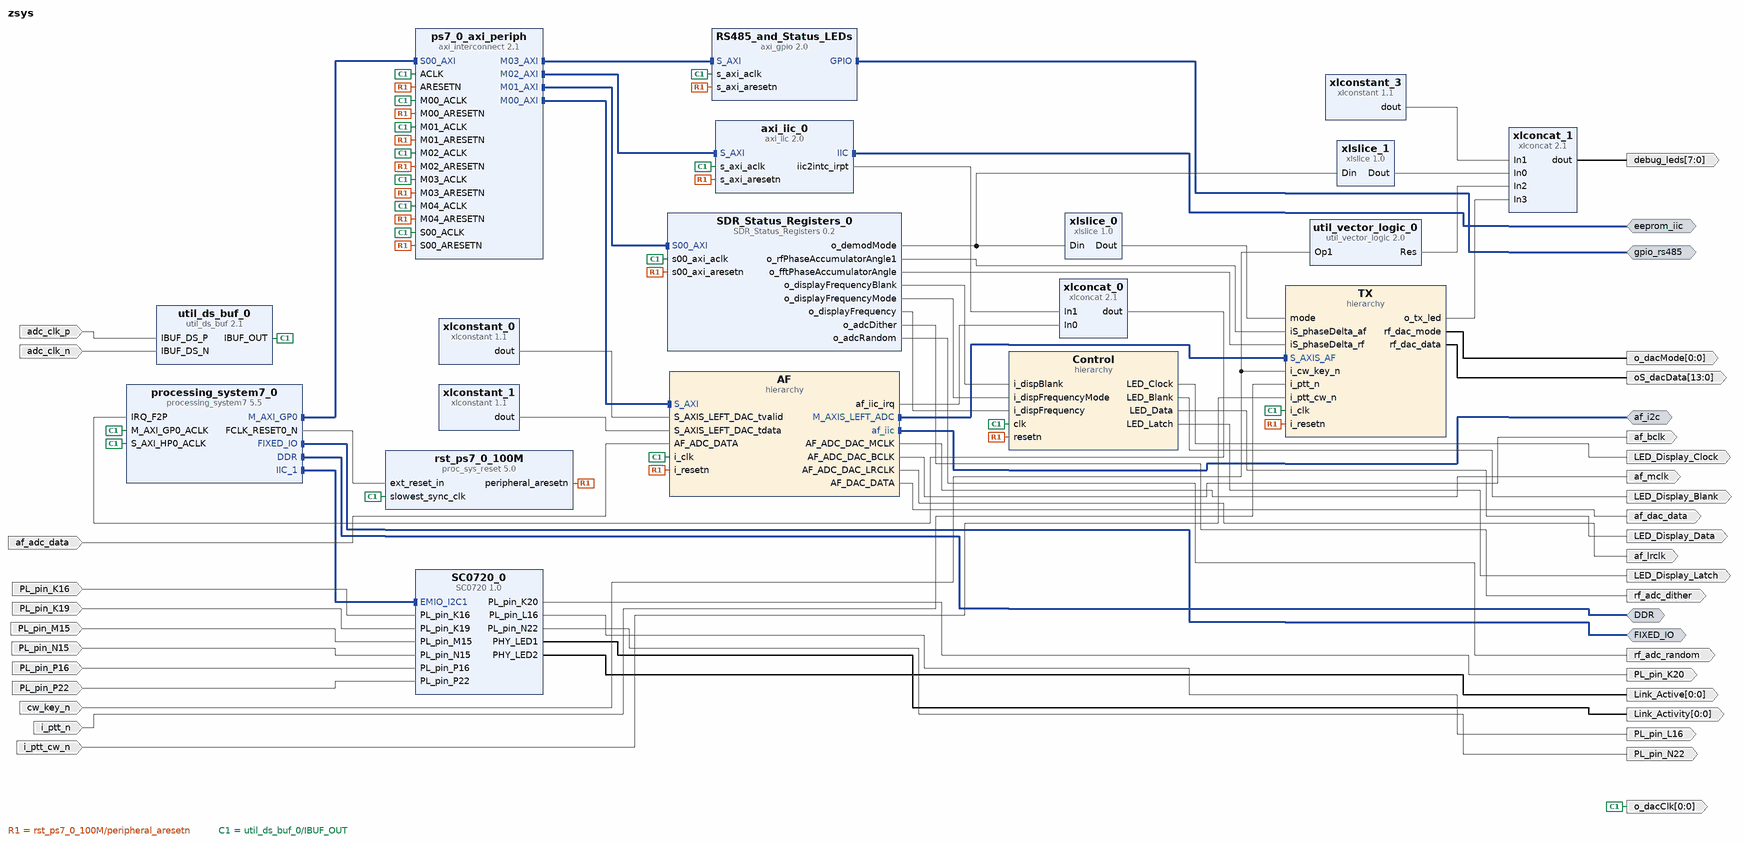
[diagram p0: block diagram of the top level]
# Vivado block design zsys, xc7z020clg484-1, Vivado 2019.2
create_bd_design zsys

create_bd_intf_port -mode Master -vlnv xilinx.com:interface:ddrx_rtl:1.0 DDR
create_bd_intf_port -mode Master -vlnv xilinx.com:display_processing_system7:fixedio_rtl:1.0 FIXED_IO
create_bd_intf_port -mode Master -vlnv xilinx.com:interface:iic_rtl:1.0 af_i2c
create_bd_intf_port -mode Master -vlnv xilinx.com:interface:gpio_rtl:1.0 gpio_rs485
create_bd_intf_port -mode Master -vlnv xilinx.com:interface:iic_rtl:1.0 eeprom_iic
create_bd_port -dir I PL_pin_K16
create_bd_port -dir I PL_pin_K19
create_bd_port -dir O PL_pin_K20
create_bd_port -dir O PL_pin_L16
create_bd_port -dir I PL_pin_M15
create_bd_port -dir I PL_pin_N15
create_bd_port -dir O PL_pin_N22
create_bd_port -dir I PL_pin_P16
create_bd_port -dir I PL_pin_P22
create_bd_port -dir O -from 0 -to 0 Link_Activity
create_bd_port -dir O -from 0 -to 0 Link_Active
create_bd_port -dir I -type clk adc_clk_p
set_property -dict {CONFIG.FREQ_HZ 80000000} [get_bd_ports adc_clk_p]
create_bd_port -dir I -type clk adc_clk_n
set_property -dict {CONFIG.FREQ_HZ 80000000} [get_bd_ports adc_clk_n]
create_bd_port -dir O LED_Display_Clock
create_bd_port -dir O LED_Display_Data
create_bd_port -dir O LED_Display_Latch
create_bd_port -dir O LED_Display_Blank
create_bd_port -dir O rf_adc_dither
create_bd_port -dir O rf_adc_random
create_bd_port -dir O -type clk af_bclk
create_bd_port -dir O -type clk af_mclk
create_bd_port -dir O -type clk af_lrclk
create_bd_port -dir O af_dac_data
create_bd_port -dir I af_adc_data
create_bd_port -dir O -from 7 -to 0 debug_leds
create_bd_port -dir O -from 13 -to 0 oS_dacData
create_bd_port -dir O -from 0 -to 0 o_dacMode
create_bd_port -dir O -from 0 -to 0 -type clk o_dacClk
create_bd_port -dir I cw_key_n
create_bd_port -dir I i_ptt_n
create_bd_port -dir I i_ptt_cw_n

create_bd_cell -type ip -vlnv trenz.biz:user:SC0720:1.0 SC0720_0
create_bd_cell -type hier Control
create_bd_cell -type hier AF
create_bd_cell -type ip -vlnv xilinx.com:ip:xlconcat:2.1 xlconcat_0
set_property -dict {CONFIG.NUM_PORTS 2} [get_bd_cells xlconcat_0]
create_bd_cell -type ip -vlnv xilinx.com:ip:processing_system7:5.5 processing_system7_0
set_property -dict [list \
  CONFIG.PCW_APU_PERIPHERAL_FREQMHZ 666.666666 \
  CONFIG.PCW_ENET0_ENET0_IO {MIO 16 .. 27} \
  CONFIG.PCW_ENET0_GRP_MDIO_ENABLE 1 \
  CONFIG.PCW_ENET0_GRP_MDIO_IO {MIO 52 .. 53} \
  CONFIG.PCW_ENET0_PERIPHERAL_ENABLE 1 \
  CONFIG.PCW_ENET_RESET_ENABLE 0 \
  CONFIG.PCW_FPGA0_PERIPHERAL_FREQMHZ 100 \
  CONFIG.PCW_FPGA1_PERIPHERAL_FREQMHZ 100 \
  CONFIG.PCW_GPIO_EMIO_GPIO_ENABLE 1 \
  CONFIG.PCW_GPIO_EMIO_GPIO_IO 64 \
  CONFIG.PCW_GPIO_MIO_GPIO_ENABLE 1 \
  CONFIG.PCW_GPIO_MIO_GPIO_IO MIO \
  CONFIG.PCW_I2C1_I2C1_IO EMIO \
  CONFIG.PCW_I2C1_PERIPHERAL_ENABLE 1 \
  CONFIG.PCW_I2C_PERIPHERAL_FREQMHZ 111.111115 \
  CONFIG.PCW_I2C_RESET_ENABLE 0 \
  CONFIG.PCW_IRQ_F2P_INTR 1 \
  CONFIG.PCW_PERIPHERAL_BOARD_PRESET part0 \
  CONFIG.PCW_PRESET_BANK1_VOLTAGE {LVCMOS 1.8V} \
  CONFIG.PCW_QSPI_GRP_FBCLK_ENABLE 1 \
  CONFIG.PCW_QSPI_GRP_FBCLK_IO {MIO 8} \
  CONFIG.PCW_QSPI_GRP_SINGLE_SS_ENABLE 1 \
  CONFIG.PCW_QSPI_GRP_SINGLE_SS_IO {MIO 1 .. 6} \
  CONFIG.PCW_QSPI_PERIPHERAL_ENABLE 1 \
  CONFIG.PCW_QSPI_QSPI_IO {MIO 1 .. 6} \
  CONFIG.PCW_SD0_GRP_CD_ENABLE 0 \
  CONFIG.PCW_SD0_GRP_WP_ENABLE 0 \
  CONFIG.PCW_SD0_PERIPHERAL_ENABLE 1 \
  CONFIG.PCW_SD0_SD0_IO {MIO 40 .. 45} \
  CONFIG.PCW_SDIO_PERIPHERAL_FREQMHZ 100 \
  CONFIG.PCW_SINGLE_QSPI_DATA_MODE x4 \
  CONFIG.PCW_TTC0_PERIPHERAL_ENABLE 1 \
  CONFIG.PCW_TTC0_TTC0_IO EMIO \
  CONFIG.PCW_TTC1_PERIPHERAL_ENABLE 1 \
  CONFIG.PCW_TTC1_TTC1_IO EMIO \
  CONFIG.PCW_UART0_PERIPHERAL_ENABLE 1 \
  CONFIG.PCW_UART0_UART0_IO {MIO 14 .. 15} \
  CONFIG.PCW_UART1_PERIPHERAL_ENABLE 1 \
  CONFIG.PCW_UART1_UART1_IO {MIO 12 .. 13} \
  CONFIG.PCW_UART_PERIPHERAL_FREQMHZ 100 \
  CONFIG.PCW_UIPARAM_DDR_FREQ_MHZ 533.333333 \
  CONFIG.PCW_UIPARAM_DDR_PARTNO {MT41J256M16 RE-125} \
  CONFIG.PCW_USB0_PERIPHERAL_ENABLE 1 \
  CONFIG.PCW_USB0_USB0_IO {MIO 28 .. 39} \
  CONFIG.PCW_USB_RESET_ENABLE 0 \
  CONFIG.PCW_USE_FABRIC_INTERRUPT 1 \
  CONFIG.PCW_USE_S_AXI_HP0 1 \
  CONFIG.PCW_WDT_PERIPHERAL_ENABLE 1 \
  CONFIG.PCW_WDT_WDT_IO EMIO \
] [get_bd_cells processing_system7_0]
# 521 more settings of processing_system7_0 are not shown: defaults, MIO pin electricals, DDR timing, and values the tool derives
create_bd_cell -type ip -vlnv xilinx.com:ip:proc_sys_reset:5.0 rst_ps7_0_100M
create_bd_cell -type ip -vlnv xilinx.com:ip:util_ds_buf:2.1 util_ds_buf_0
create_bd_cell -type ip -vlnv user.org:user:SDR_Status_Registers:0.2 SDR_Status_Registers_0
create_bd_cell -type hier TX
create_bd_cell -type ip -vlnv xilinx.com:ip:axi_interconnect:2.1 ps7_0_axi_periph
set_property -dict {CONFIG.NUM_MI 5} [get_bd_cells ps7_0_axi_periph]
create_bd_cell -type ip -vlnv xilinx.com:ip:xlslice:1.0 xlslice_0
set_property -dict {CONFIG.DIN_FROM 3 CONFIG.DIN_WIDTH 8 CONFIG.DOUT_WIDTH 4} [get_bd_cells xlslice_0]
create_bd_cell -type ip -vlnv xilinx.com:ip:xlconstant:1.1 xlconstant_0
create_bd_cell -type ip -vlnv xilinx.com:ip:xlconstant:1.1 xlconstant_1
set_property -dict {CONFIG.CONST_VAL 0 CONFIG.CONST_WIDTH 16} [get_bd_cells xlconstant_1]
create_bd_cell -type ip -vlnv xilinx.com:ip:xlslice:1.0 xlslice_1
set_property -dict {CONFIG.DIN_FROM 3 CONFIG.DIN_WIDTH 8 CONFIG.DOUT_WIDTH 4} [get_bd_cells xlslice_1]
create_bd_cell -type ip -vlnv xilinx.com:ip:xlconcat:2.1 xlconcat_1
set_property -dict {CONFIG.NUM_PORTS 4} [get_bd_cells xlconcat_1]
create_bd_cell -type ip -vlnv xilinx.com:ip:xlconstant:1.1 xlconstant_3
set_property -dict {CONFIG.CONST_VAL 0 CONFIG.CONST_WIDTH 2} [get_bd_cells xlconstant_3]
create_bd_cell -type ip -vlnv xilinx.com:ip:util_vector_logic:2.0 util_vector_logic_0
set_property -dict {CONFIG.C_OPERATION not CONFIG.C_SIZE 1} [get_bd_cells util_vector_logic_0]
create_bd_cell -type ip -vlnv xilinx.com:ip:axi_iic:2.0 axi_iic_0
create_bd_cell -type ip -vlnv xilinx.com:ip:axi_gpio:2.0 RS485_and_Status_LEDs
set_property -dict {CONFIG.C_ALL_OUTPUTS 0 CONFIG.C_GPIO_WIDTH 6 CONFIG.C_IS_DUAL 0} [get_bd_cells RS485_and_Status_LEDs]

# ---- hierarchy /Control ----
current_bd_instance /Control
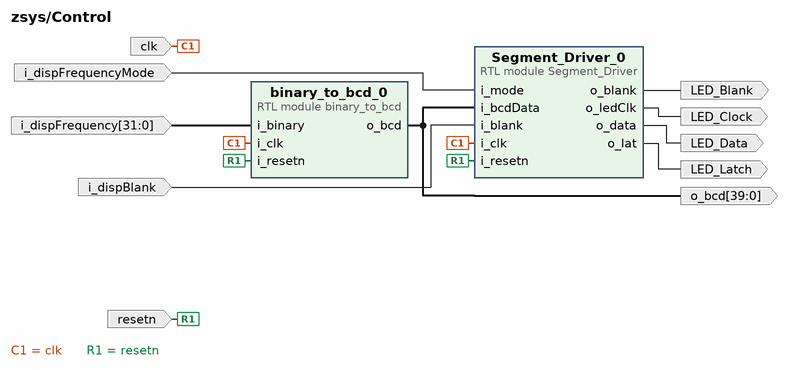
[diagram p1: block diagram inside /Control]
create_bd_pin -dir I clk
create_bd_pin -dir I resetn
create_bd_pin -dir O LED_Clock
create_bd_pin -dir O LED_Data
create_bd_pin -dir O LED_Latch
create_bd_pin -dir O LED_Blank
create_bd_pin -dir I -from 31 -to 0 i_dispFrequency
create_bd_pin -dir I i_dispFrequencyMode
create_bd_pin -dir I i_dispBlank
create_bd_pin -dir O -from 39 -to 0 o_bcd

create_bd_cell -type module -reference binary_to_bcd binary_to_bcd_0
set_property -dict {CONFIG.DECIMAL_DIGITS 10 CONFIG.INPUT_WIDTH 32} [get_bd_cells binary_to_bcd_0]
create_bd_cell -type module -reference Segment_Driver Segment_Driver_0

# ---- hierarchy /AF ----
current_bd_instance /AF
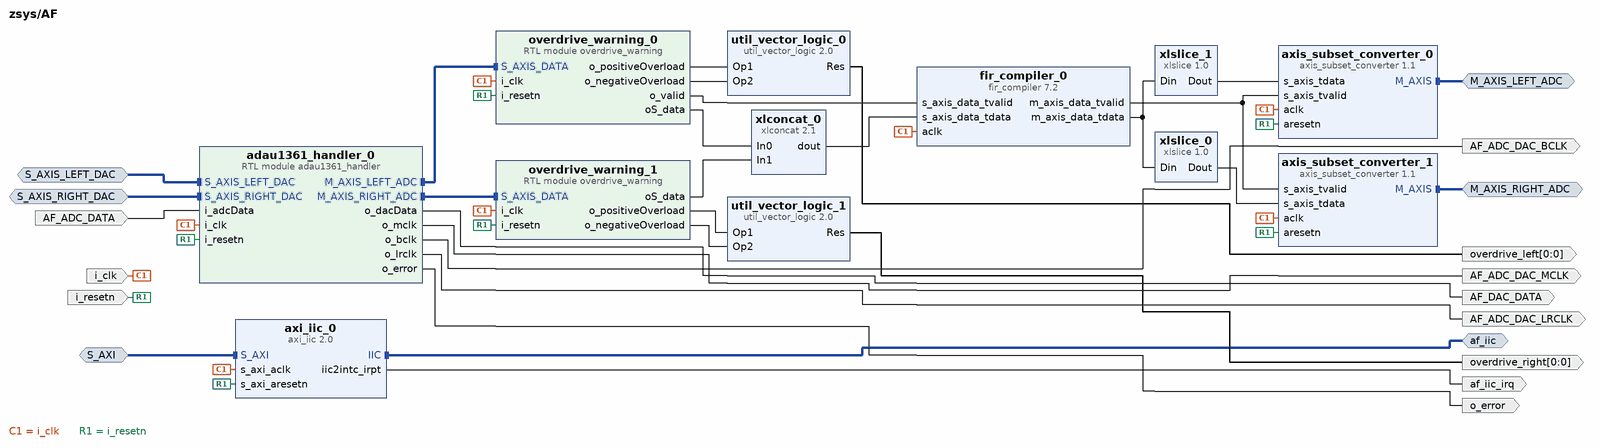
[diagram p2: block diagram inside /AF]
create_bd_intf_pin -mode Slave -vlnv xilinx.com:interface:aximm_rtl:1.0 S_AXI
create_bd_intf_pin -mode Master -vlnv xilinx.com:interface:iic_rtl:1.0 af_iic
create_bd_intf_pin -mode Master -vlnv xilinx.com:interface:axis_rtl:1.0 M_AXIS_LEFT_ADC
create_bd_intf_pin -mode Master -vlnv xilinx.com:interface:axis_rtl:1.0 M_AXIS_RIGHT_ADC
create_bd_intf_pin -mode Slave -vlnv xilinx.com:interface:axis_rtl:1.0 S_AXIS_LEFT_DAC
create_bd_intf_pin -mode Slave -vlnv xilinx.com:interface:axis_rtl:1.0 S_AXIS_RIGHT_DAC
create_bd_pin -dir I i_clk
create_bd_pin -dir O AF_ADC_DAC_MCLK
create_bd_pin -dir O AF_ADC_DAC_BCLK
create_bd_pin -dir O AF_ADC_DAC_LRCLK
create_bd_pin -dir I i_resetn
create_bd_pin -dir O af_iic_irq
create_bd_pin -dir O AF_DAC_DATA
create_bd_pin -dir I AF_ADC_DATA
create_bd_pin -dir O -from 0 -to 0 overdrive_left
create_bd_pin -dir O -from 0 -to 0 overdrive_right
create_bd_pin -dir O o_error

create_bd_cell -type ip -vlnv xilinx.com:ip:axi_iic:2.0 axi_iic_0
set_property -dict {CONFIG.C_SCL_INERTIAL_DELAY 30 CONFIG.C_SDA_INERTIAL_DELAY 4} [get_bd_cells axi_iic_0]
create_bd_cell -type module -reference overdrive_warning overdrive_warning_0
create_bd_cell -type module -reference overdrive_warning overdrive_warning_1
create_bd_cell -type ip -vlnv xilinx.com:ip:fir_compiler:7.2 fir_compiler_0
set_property -dict [list \
  CONFIG.BestPrecision true \
  CONFIG.Clock_Frequency 80 \
  CONFIG.CoefficientVector {0.0006017081117752789,   0.00021698174443565994,   0.00020156548976001752,   0.00014513363278048318,   0.00005070559211108667,   -0.00007106179770952879,   -0.00020294484311072142,   -0.00032401594539006943,   -0.0004133589536671213,   -0.00045399678625327903,   -0.0004366354368462227,   -0.0003622340522348285,   -0.000242517995835705,   -0.00009834613008847372,   0.000043737650503994175,   0.00015637313179047422,   0.00021689341008021646,   0.00021222332797243967,   0.00014201166446065245,   0.000019357889745307187,   -0.00013110280096560948,   -0.0002776377128822356,   -0.0003876736678100843,   -0.00043459699567176475,   -0.0004036590352339894,   -0.000295744645545904,   -0.00012810486447302737,   0.00006831644601745875,   0.0002546055382030617,   0.00039160868376282354,   0.00044817789114791156,   0.0004082370098746187,   0.0002750687101153801,   0.0000717322092954802,   -0.000162661529789659,   -0.00038024479219731823,   -0.0005339602983436044,   -0.0005875380844864783,   -0.0005237705573172044,   -0.00034921375316935633,   -0.00009412872627630275,   0.0001925820538801017,   0.00045265529859966176,   0.0006302280346493054,   0.0006837222437681512,   0.0005953670819798373,   0.00037623573167553254,   0.0000654743830746401,   -0.00027644451909361915,   -0.000579327800915809,   -0.0007775187846771833,   -0.0008239434001388537,   -0.0007009752868251534,   -0.00042565495755496525,   -0.00004787580782989473,   0.00035842485418590304,   0.0007095733116967656,   0.0009292489095714983,   0.0009648978713199216,   0.0007999680445826354,   0.0004591770212609978,   0.000005359853837119094,   -0.0004718630953643613,   -0.0008736128476705366,   -0.0011120691334370342,   -0.0011294333131689363,   -0.0009114979049915206,   -0.0004927161022150633,   0.000048712213403736885,   0.0006051824283553711,   0.0010608780545121412,   0.0013156838978517946,   0.00130692517946355,   0.0010242527005374232,   0.0005142238657530738,   -0.00012684020586012536,   -0.0007707490486527846,   -0.001282842279097082,   -0.001549921952346763,   -0.001504962753878516,   -0.00114325938386286,   -0.0005262382010059911,   0.00022842935131315485,   0.0009689639206096996,   0.001539760584381881,   0.0018138145366206136,   0.0017205982854002493,   0.0012633540090470653,   0.0005216841548601011,   -0.00036176626591647614,   -0.0012084135726673163,   -0.0018395258384572288,   -0.002113607212373283,   -0.001957643922758817,   -0.0013853937552829553,   -0.0004983193364323939,   0.000531779845704317,   0.0014956238042692126,   0.002188629428337861,   0.0024539625197676227,   0.002217443961092526,   0.001506663244018722,   0.0004496430855842754,   -0.0007475811784565236,   -0.001840698823943102,   -0.0025965371498616013,   -0.002842214882814595,   -0.0025038787515871503,   -0.0016265620784683388,   -0.00037008396327911717,   0.0010193191579899057,   0.002256724085648409,   0.003076435629711162,   0.0032884403713000676,   0.002821447106343092,   0.0017428502211384533,   0.00025070736251735584,   -0.001361493974610037,   -0.0027615023622913205,   -0.003646275915375085,   -0.00380732525961702,   -0.003178371105316936,   -0.0018541560841357912,   -0.00007875269023135716,   0.0017951425080673913,   0.003381434556273129,   0.00433355052385623,   0.004422135910484142,   0.0035869695260376286,   0.0019585541052840176,   -0.00016059808200474002,   -0.0023507388387758715,   -0.004156409374887954,   -0.005179771993432773,   -0.0051667252489220215,   -0.004067083437099234,   -0.0020552000859830398,   0.0004948393982279724,   0.003076692419402504,   0.005150372804830213,   0.006253124163822241,   0.006100022657851296,   0.004652968535412203,   0.0021422556417744713,   -0.0009662873159771815,   -0.004054825599820006,   -0.0064732748989426,   -0.007672624899963379,   -0.007325182806879691,   -0.005406224003316856,   -0.0022179425206576803,   0.001652628446982068,   0.005437010821546088,   0.00833260371927803,   0.009666664311599479,   0.009044592995173076,   0.006451281868277574,   0.002281820289788967,   -0.002709422152839851,   -0.007536686685258467,   -0.011167366880504672,   -0.012730227944703307,   -0.011707429190244324,   -0.008070974489882097,   -0.0023323619891411087,   0.004511117464752529,   0.01113116112334622,   0.01610247469063117,   0.01817760594950707,   0.01655380852156582,   0.011081263268284163,   0.0023694083483853734,   -0.008236014334986407,   -0.01881086779249836,   -0.027127291673754512,   -0.03100512071230612,   -0.028684251726358734,   -0.01915553122886009,   -0.0023917850776806263,   0.020565029025579964,   0.04768206547330468,   0.07617377555958868,   0.10286773820677735,   0.12464382149279006,   0.1388790150498258,   0.14382801220807023,   0.1388790150498258,   0.12464382149279006,   0.10286773820677735,   0.07617377555958868,   0.04768206547330468,   0.020565029025579964,   -0.0023917850776806263,   -0.01915553122886009,   -0.028684251726358734,   -0.03100512071230612,   -0.027127291673754512,   -0.01881086779249836,   -0.008236014334986407,   0.0023694083483853734,   0.011081263268284163,   0.01655380852156582,   0.01817760594950707,   0.01610247469063117,   0.01113116112334622,   0.004511117464752529,   -0.0023323619891411087,   -0.008070974489882097,   -0.011707429190244324,   -0.012730227944703307,   -0.011167366880504672,   -0.007536686685258467,   -0.002709422152839851,   0.002281820289788967,   0.006451281868277574,   0.009044592995173076,   0.009666664311599479,   0.00833260371927803,   0.005437010821546088,   0.001652628446982068,   -0.0022179425206576803,   -0.005406224003316856,   -0.007325182806879691,   -0.007672624899963379,   -0.0064732748989426,   -0.004054825599820006,   -0.0009662873159771815,   0.0021422556417744713,   0.004652968535412203,   0.006100022657851296,   0.006253124163822241,   0.005150372804830213,   0.003076692419402504,   0.0004948393982279724,   -0.0020552000859830398,   -0.004067083437099234,   -0.0051667252489220215,   -0.005179771993432773,   -0.004156409374887954,   -0.0023507388387758715,   -0.00016059808200474002,   0.0019585541052840176,   0.0035869695260376286,   0.004422135910484142,   0.00433355052385623,   0.003381434556273129,   0.0017951425080673913,   -0.00007875269023135716,   -0.0018541560841357912,   -0.003178371105316936,   -0.00380732525961702,   -0.003646275915375085,   -0.0027615023622913205,   -0.001361493974610037,   0.00025070736251735584,   0.0017428502211384533,   0.002821447106343092,   0.0032884403713000676,   0.003076435629711162,   0.002256724085648409,   0.0010193191579899057,   -0.00037008396327911717,   -0.0016265620784683388,   -0.0025038787515871503,   -0.002842214882814595,   -0.0025965371498616013,   -0.001840698823943102,   -0.0007475811784565236,   0.0004496430855842754,   0.001506663244018722,   0.002217443961092526,   0.0024539625197676227,   0.002188629428337861,   0.0014956238042692126,   0.000531779845704317,   -0.0004983193364323939,   -0.0013853937552829553,   -0.001957643922758817,   -0.002113607212373283,   -0.0018395258384572288,   -0.0012084135726673163,   -0.00036176626591647614,   0.0005216841548601011,   0.0012633540090470653,   0.0017205982854002493,   0.0018138145366206136,   0.001539760584381881,   0.0009689639206096996,   0.00022842935131315485,   -0.0005262382010059911,   -0.00114325938386286,   -0.001504962753878516,   -0.001549921952346763,   -0.001282842279097082,   -0.0007707490486527846,   -0.00012684020586012536,   0.0005142238657530738,   0.0010242527005374232,   0.00130692517946355,   0.0013156838978517946,   0.0010608780545121412,   0.0006051824283553711,   0.000048712213403736885,   -0.0004927161022150633,   -0.0009114979049915206,   -0.0011294333131689363,   -0.0011120691334370342,   -0.0008736128476705366,   -0.0004718630953643613,   0.000005359853837119094,   0.0004591770212609978,   0.0007999680445826354,   0.0009648978713199216,   0.0009292489095714983,   0.0007095733116967656,   0.00035842485418590304,   -0.00004787580782989473,   -0.00042565495755496525,   -0.0007009752868251534,   -0.0008239434001388537,   -0.0007775187846771833,   -0.000579327800915809,   -0.00027644451909361915,   0.0000654743830746401,   0.00037623573167553254,   0.0005953670819798373,   0.0006837222437681512,   0.0006302280346493054,   0.00045265529859966176,   0.0001925820538801017,   -0.00009412872627630275,   -0.00034921375316935633,   -0.0005237705573172044,   -0.0005875380844864783,   -0.0005339602983436044,   -0.00038024479219731823,   -0.000162661529789659,   0.0000717322092954802,   0.0002750687101153801,   0.0004082370098746187,   0.00044817789114791156,   0.00039160868376282354,   0.0002546055382030617,   0.00006831644601745875,   -0.00012810486447302737,   -0.000295744645545904,   -0.0004036590352339894,   -0.00043459699567176475,   -0.0003876736678100843,   -0.0002776377128822356,   -0.00013110280096560948,   0.000019357889745307187,   0.00014201166446065245,   0.00021222332797243967,   0.00021689341008021646,   0.00015637313179047422,   0.000043737650503994175,   -0.00009834613008847372,   -0.000242517995835705,   -0.0003622340522348285,   -0.0004366354368462227,   -0.00045399678625327903,   -0.0004133589536671213,   -0.00032401594539006943,   -0.00020294484311072142,   -0.00007106179770952879,   0.00005070559211108667,   0.00014513363278048318,   0.00020156548976001752,   0.00021698174443565994,   0.0006017081117752789} \
  CONFIG.Coefficient_Fractional_Bits 17 \
  CONFIG.Coefficient_Sets 1 \
  CONFIG.Coefficient_Sign Signed \
  CONFIG.Coefficient_Structure Inferred \
  CONFIG.Coefficient_Width 16 \
  CONFIG.Data_Width 16 \
  CONFIG.Filter_Architecture Systolic_Multiply_Accumulate \
  CONFIG.Number_Paths 2 \
  CONFIG.Output_Rounding_Mode Truncate_LSBs \
  CONFIG.Output_Width 18 \
  CONFIG.Passband_Max 0.14 \
  CONFIG.Quantization Quantize_Only \
  CONFIG.Sample_Frequency 0.0390625 \
] [get_bd_cells fir_compiler_0]
create_bd_cell -type ip -vlnv xilinx.com:ip:util_vector_logic:2.0 util_vector_logic_0
set_property -dict {CONFIG.C_OPERATION or CONFIG.C_SIZE 1} [get_bd_cells util_vector_logic_0]
create_bd_cell -type ip -vlnv xilinx.com:ip:util_vector_logic:2.0 util_vector_logic_1
set_property -dict {CONFIG.C_OPERATION or CONFIG.C_SIZE 1} [get_bd_cells util_vector_logic_1]
create_bd_cell -type ip -vlnv xilinx.com:ip:xlconcat:2.1 xlconcat_0
create_bd_cell -type ip -vlnv xilinx.com:ip:xlslice:1.0 xlslice_0
set_property -dict {CONFIG.DIN_FROM 39 CONFIG.DIN_TO 24 CONFIG.DIN_WIDTH 48 CONFIG.DOUT_WIDTH 16} [get_bd_cells xlslice_0]
create_bd_cell -type ip -vlnv xilinx.com:ip:xlslice:1.0 xlslice_1
set_property -dict {CONFIG.DIN_FROM 15 CONFIG.DIN_TO 0 CONFIG.DIN_WIDTH 48 CONFIG.DOUT_WIDTH 16} [get_bd_cells xlslice_1]
create_bd_cell -type ip -vlnv xilinx.com:ip:axis_subset_converter:1.1 axis_subset_converter_0
set_property -dict [list \
  CONFIG.M_HAS_TREADY 0 \
  CONFIG.M_TDATA_NUM_BYTES 2 \
  CONFIG.S_HAS_TREADY 0 \
  CONFIG.S_TDATA_NUM_BYTES 2 \
  CONFIG.TDATA_REMAP {tdata[15:0]} \
] [get_bd_cells axis_subset_converter_0]
create_bd_cell -type ip -vlnv xilinx.com:ip:axis_subset_converter:1.1 axis_subset_converter_1
set_property -dict [list \
  CONFIG.M_HAS_TREADY 0 \
  CONFIG.M_TDATA_NUM_BYTES 2 \
  CONFIG.S_HAS_TREADY 0 \
  CONFIG.S_TDATA_NUM_BYTES 2 \
  CONFIG.TDATA_REMAP {tdata[15:0]} \
] [get_bd_cells axis_subset_converter_1]
create_bd_cell -type module -reference adau1361_handler adau1361_handler_0

# ---- hierarchy /TX ----
current_bd_instance /TX
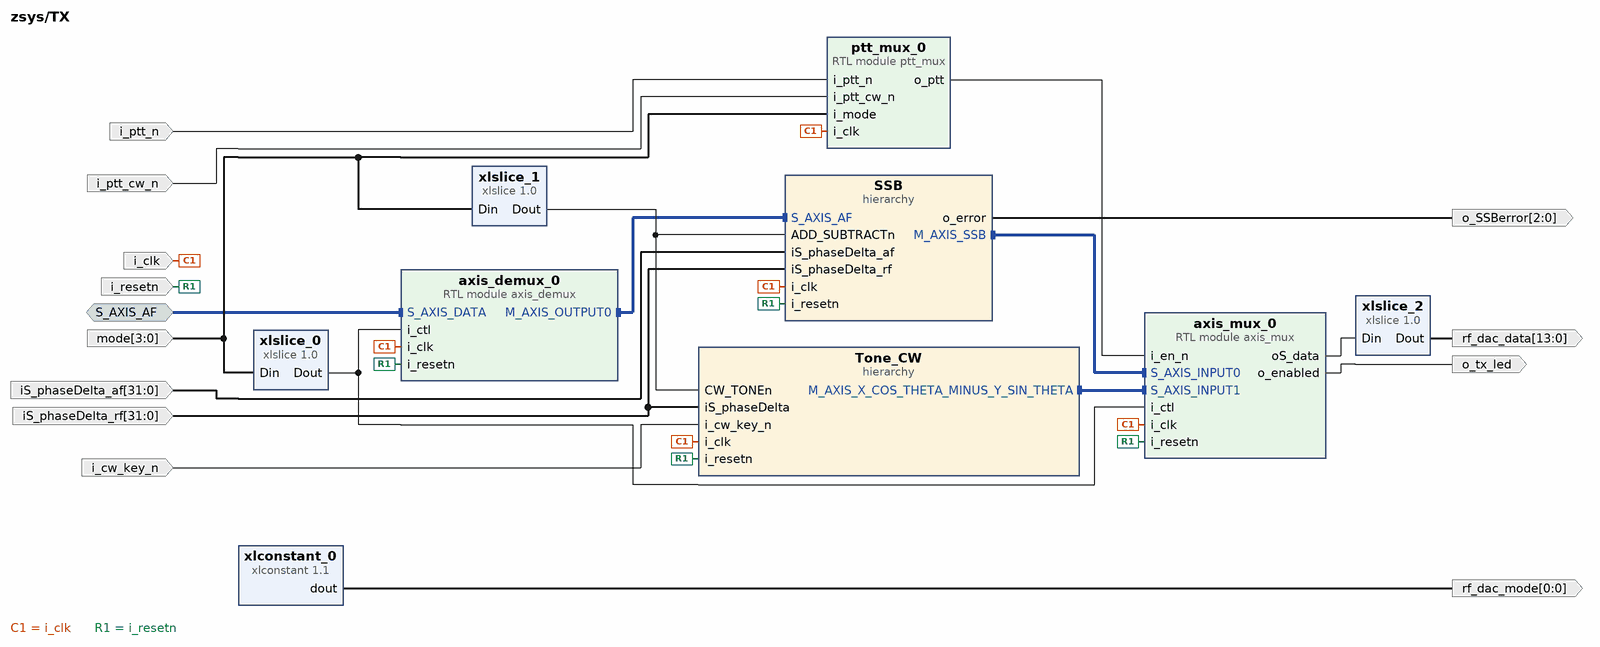
[diagram p3: block diagram inside /TX]
create_bd_intf_pin -mode Slave -vlnv xilinx.com:interface:axis_rtl:1.0 S_AXIS_AF
create_bd_pin -dir I i_clk
create_bd_pin -dir I i_resetn
create_bd_pin -dir I -from 31 -to 0 iS_phaseDelta_af
create_bd_pin -dir I -from 31 -to 0 iS_phaseDelta_rf
create_bd_pin -dir I -from 3 -to 0 mode
create_bd_pin -dir O -from 13 -to 0 rf_dac_data
create_bd_pin -dir O -from 0 -to 0 rf_dac_mode
create_bd_pin -dir O -from 2 -to 0 o_SSBerror
create_bd_pin -dir I i_cw_key_n
create_bd_pin -dir I i_ptt_n
create_bd_pin -dir O o_tx_led
create_bd_pin -dir I i_ptt_cw_n

create_bd_cell -type hier SSB
create_bd_cell -type ip -vlnv xilinx.com:ip:xlconstant:1.1 xlconstant_0
create_bd_cell -type ip -vlnv xilinx.com:ip:xlslice:1.0 xlslice_2
set_property -dict {CONFIG.DIN_FROM 15 CONFIG.DIN_TO 2 CONFIG.DIN_WIDTH 16 CONFIG.DOUT_WIDTH 14} [get_bd_cells xlslice_2]
create_bd_cell -type module -reference axis_demux axis_demux_0
create_bd_cell -type ip -vlnv xilinx.com:ip:xlslice:1.0 xlslice_0
set_property -dict {CONFIG.DIN_FROM 3 CONFIG.DIN_TO 1 CONFIG.DIN_WIDTH 4 CONFIG.DOUT_WIDTH 3} [get_bd_cells xlslice_0]
create_bd_cell -type ip -vlnv xilinx.com:ip:xlslice:1.0 xlslice_1
set_property -dict {CONFIG.DIN_WIDTH 4} [get_bd_cells xlslice_1]
create_bd_cell -type hier Tone_CW
create_bd_cell -type module -reference axis_mux axis_mux_0
create_bd_cell -type module -reference ptt_mux ptt_mux_0

# ---- hierarchy /TX/SSB ----
current_bd_instance /TX/SSB
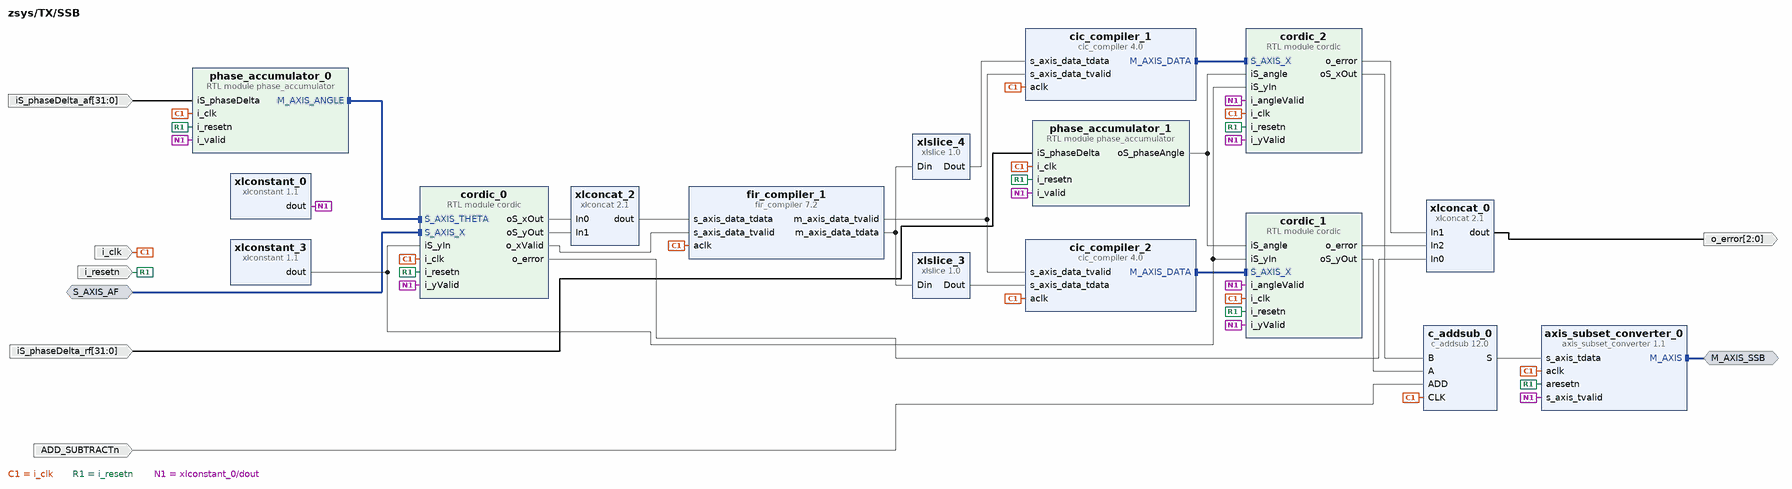
[diagram p4: block diagram inside /TX/SSB]
create_bd_intf_pin -mode Slave -vlnv xilinx.com:interface:axis_rtl:1.0 S_AXIS_AF
create_bd_intf_pin -mode Master -vlnv xilinx.com:interface:axis_rtl:1.0 M_AXIS_SSB
create_bd_pin -dir I -type clk i_clk
create_bd_pin -dir I -type rst i_resetn
create_bd_pin -dir I ADD_SUBTRACTn
create_bd_pin -dir I -from 31 -to 0 iS_phaseDelta_af
create_bd_pin -dir I -from 31 -to 0 iS_phaseDelta_rf
create_bd_pin -dir O -from 2 -to 0 o_error

create_bd_cell -type ip -vlnv xilinx.com:ip:c_addsub:12.0 c_addsub_0
set_property -dict [list \
  CONFIG.A_Width 16 \
  CONFIG.Add_Mode Add_Subtract \
  CONFIG.B_Value 0000000000000000 \
  CONFIG.B_Width 16 \
  CONFIG.CE false \
  CONFIG.Latency 1 \
  CONFIG.Out_Width 16 \
] [get_bd_cells c_addsub_0]
create_bd_cell -type ip -vlnv xilinx.com:ip:cic_compiler:4.0 cic_compiler_1
set_property -dict [list \
  CONFIG.Clock_Frequency 80.0 \
  CONFIG.Fixed_Or_Initial_Rate 2048 \
  CONFIG.Input_Data_Width 16 \
  CONFIG.Input_Sample_Frequency 0.0390625 \
  CONFIG.Maximum_Rate 2048 \
  CONFIG.Minimum_Rate 2048 \
  CONFIG.Number_Of_Channels 1 \
  CONFIG.Number_Of_Stages 3 \
  CONFIG.Output_Data_Width 16 \
  CONFIG.Passband_Max 0.0005 \
  CONFIG.Quantization Truncation \
  CONFIG.SamplePeriod 2048 \
] [get_bd_cells cic_compiler_1]
create_bd_cell -type ip -vlnv xilinx.com:ip:cic_compiler:4.0 cic_compiler_2
set_property -dict [list \
  CONFIG.Clock_Frequency 80.0 \
  CONFIG.Fixed_Or_Initial_Rate 2048 \
  CONFIG.Input_Data_Width 16 \
  CONFIG.Input_Sample_Frequency 0.0390625 \
  CONFIG.Maximum_Rate 2048 \
  CONFIG.Minimum_Rate 2048 \
  CONFIG.Number_Of_Channels 1 \
  CONFIG.Number_Of_Stages 3 \
  CONFIG.Output_Data_Width 16 \
  CONFIG.Passband_Max 0.0005 \
  CONFIG.Quantization Truncation \
  CONFIG.SamplePeriod 2048 \
] [get_bd_cells cic_compiler_2]
create_bd_cell -type ip -vlnv xilinx.com:ip:fir_compiler:7.2 fir_compiler_1
set_property -dict [list \
  CONFIG.BestPrecision true \
  CONFIG.Clock_Frequency 80 \
  CONFIG.CoefficientVector {0.0005301568549654419,   0.00006393518835997023,   0.00005738859167497046,   0.00004338987340945184,   0.000022051781979735328,   -0.000006054306049617033,   -0.000039902767616475936,   -0.00007804283517097216,   -0.0001186388087130439,   -0.00015955622832839858,   -0.0001984953979661791,   -0.00023311541520489666,   -0.0002611586599345181,   -0.00028062548439992436,   -0.00028992567773032543,   -0.0002879368651991218,   -0.0002742106705087938,   -0.0002489361329191936,   -0.00021303349632444135,   -0.00016809634890038163,   -0.00011634577318997903,   -0.000060511281161317194,   -0.000003688661722200005,   0.0000508377439375819,   0.00009980215742912645,   0.00014016394028108106,   0.000169310394930918,   0.00018524211352920688,   0.00018673567812981485,   0.00017343075036938728,   0.00014592102244833006,   0.00010572238453748261,   0.000055232882823971535,   -0.0000024003125301238913,   -0.00006345356526636345,   -0.00012385235513596654,   -0.00017942246677473764,   -0.0002261646704303122,   -0.000260526856272902,   -0.00027965012631829084,   -0.0002815916087452791,   -0.00026547384374199176,   -0.00023160885529887796,   -0.0001814837031024612,   -0.00011776095198315651,   -0.000044098110812567134,   0.000035032386958893286,   0.00011461260383671019,   0.00018940544462782473,   0.0002542878255710424,   0.00030458741680297754,   0.00033642180707489595,   0.00034699041514079,   0.0003347959010194655,   0.0002998149965532201,   0.0002434926958732427,   0.0001688760903703858,   0.00008008576600868937,   -0.00001734509806522312,   -0.00011732693541286485,   -0.00021333152346519798,   -0.0002987866621040009,   -0.00036762652442667745,   -0.0004147068291232882,   -0.0004361099606421561,   -0.000429457843764001,   -0.00039418390808593776,   -0.00033162035114237876,   -0.0002449186151089871,   -0.00013896311495607429,   -0.000020166158144706697,   0.00010416148869187228,   0.00022589524756009278,   0.00033691599464366406,   0.00042947404620668735,   0.0004967997326186481,   0.0005335608410174303,   0.0005362775862422715,   0.0005036088973071943,   0.00043650856599329027,   0.00033825202758871326,   0.00021429997639582185,   0.00007200257602023325,   -0.00007982067509942405,   -0.0002314093793162946,   -0.0003727170550386536,   -0.000494025244426794,   -0.0005866424789596213,   -0.000643486733954927,   -0.0006596245513453766,   -0.0006326601935657222,   -0.0005629833876251326,   -0.00045382984825060316,   -0.0003111571247278629,   -0.00014333892110813761,   0.00003931805718642359,   0.00022519228698186753,   0.0004020847729695572,   0.0005579915616065953,   0.0006819337788356992,   0.0007646822009075012,   0.0007994555785811166,   0.0007824338551323459,   0.0007131114699884057,   0.0005944430740028248,   0.00043275818252203974,   0.00023744003425329248,   0.000020399274920475764,   -0.00020464262115528622,   -0.0004230233874884904,   -0.0006200732590545277,   -0.0007821208248811516,   -0.000897362686812131,   -0.0009568042954846602,   -0.0009547905850631885,   -0.0008895905757156121,   -0.0007635820851814426,   -0.0005832164731654933,   -0.00035877793517834314,   -0.00010383988081828998,   0.00016555266050530552,   0.00043189857532070964,   0.0006774367303066042,   0.0008854470209305067,   0.0010414177918416578,   0.0011336520402371708,   0.0011519944458426004,   0.0010960206443678296,   0.0009654152376523162,   0.0007671603127385662,   0.0005123421637660198,   0.00021616348528699387,   -0.00010298891272177306,   -0.0004246567309961579,   -0.0007276145004782092,   -0.0009912667647061417,   -0.0011970156074253917,   -0.001329547081515234,   -0.0013779636776103654,   -0.0013366209293878613,   -0.0012056256623930758,   -0.0009910724726092186,   -0.0007047206370885805,   -0.00036345552027128753,   0.000011731244250112979,   0.0003969877785688768,   0.00076711155347287,   0.0010971690601370375,   0.0013641559100392852,   0.0015485794642970752,   0.0016358459625094193,   0.0016173698860029084,   0.0014913158837831816,   0.0012629191480759366,   0.000944326487340492,   0.0005540213551563383,   0.00011574982950438409,   -0.00034287000733014057,   -0.000792079634267749,   -0.0012018797670332306,   -0.0015440089356608972,   -0.001793859176708545,   -0.0019322138049301621,   -0.0019466731268055683,   -0.0018326691770784896,   -0.0015940021826009595,   -0.0012428197120235036,   -0.0007990774224528687,   -0.00028941082924474056,   0.00025437089746305067,   0.000797299787369804,   0.0013034181032845064,   0.0017381439666380053,   0.0020706069482448867,   0.0022757795325427503,   0.0023362996660734082,   0.0022438551652613466,   0.0019999944716107944,   0.0016163143908594045,   0.001114010174529067,   0.0005227215791995615,   -0.00012101574080627546,   -0.0007764331474456598,   -0.0014001978810090166,   -0.0019503095882062893,   -0.0023880728837908185,   -0.0026809725121795087,   -0.002805173737211216,   -0.0027472737341876293,   -0.0025054206570715313,   -0.0020898280849919303,   -0.0015225308997630555,   -0.0008362811072038716,   -0.00007270416786720615,   0.0007201199605118557,   0.001490646413100908,   0.0021872497160790234,   0.002761372269113474,   0.003171069733063798,   0.003383798020458287,   0.003378966636892171,   0.003149646297186104,   0.0027034918195447777,   0.00206270799595422,   0.0012630732141493894,   0.00035205388019120514,   -0.0006139194751949582,   -0.0015728490334750694,   -0.002461036451749209,   -0.003217201081156495,   -0.0037866055141977718,   -0.0041248364214982024,   -0.004201123998901283,   -0.004000809374671624,   -0.0035269045389464504,   -0.0028005255375260817,   -0.0018601823173922036,   -0.0007599023966185753,   0.00043371262469512446,   0.0016453546642979523,   0.002795590463716705,   0.003805874949574743,   0.004603712117462733,   0.005127603779279628,   0.005331520270797173,   0.005188484672270496,   0.00469314561648354,   0.0038629929995671075,   0.0027381922639710364,   0.001379950530595239,   -0.00013254016461915194,   -0.0017064342169246405,   -0.003240606756407896,   -0.004631797059484829,   -0.005781159362595332,   -0.006600809081323297,   -0.007020012380366093,   -0.006990497186692081,   -0.006490758261857952,   -0.0055285861032288225,   -0.004142235439676081,   -0.002399426051803042,   -0.0003946233151478414,   0.001755433875111008,   0.0039178700168579,   0.00595110642073332,   0.007713205073545164,   0.009070739078918753,   0.00990763242707658,   0.010133282593012936,   0.009689443196368193,   0.008555855020965557,   0.00675518326666639,   0.004352040965713982,   0.0014544369801845795,   -0.0017910185571532661,   -0.005204327782385749,   -0.008580082850399814,   -0.011697092236250928,   -0.014329362588497825,   -0.016257841755380004,   -0.017282305599660427,   -0.017232791346250182,   -0.015979931612452255,   -0.013443571275528527,   -0.009599208215107582,   -0.004481882465604279,   0.0018129257893003154,   0.009131250073131507,   0.017265692931829946,   0.025963174768729863,   0.03493517532213005,   0.04386991998818515,   0.0524459739538281,   0.060346560080020394,   0.06727389192732537,   0.07296281727721064,   0.07719307035726908,   0.0797995204503935,   0.08067987951980564,   0.0797995204503935,   0.07719307035726908,   0.07296281727721064,   0.06727389192732537,   0.060346560080020394,   0.0524459739538281,   0.04386991998818515,   0.03493517532213005,   0.025963174768729863,   0.017265692931829946,   0.009131250073131507,   0.0018129257893003154,   -0.004481882465604279,   -0.009599208215107582,   -0.013443571275528527,   -0.015979931612452255,   -0.017232791346250182,   -0.017282305599660427,   -0.016257841755380004,   -0.014329362588497825,   -0.011697092236250928,   -0.008580082850399814,   -0.005204327782385749,   -0.0017910185571532661,   0.0014544369801845795,   0.004352040965713982,   0.00675518326666639,   0.008555855020965557,   0.009689443196368193,   0.010133282593012936,   0.00990763242707658,   0.009070739078918753,   0.007713205073545164,   0.00595110642073332,   0.0039178700168579,   0.001755433875111008,   -0.0003946233151478414,   -0.002399426051803042,   -0.004142235439676081,   -0.0055285861032288225,   -0.006490758261857952,   -0.006990497186692081,   -0.007020012380366093,   -0.006600809081323297,   -0.005781159362595332,   -0.004631797059484829,   -0.003240606756407896,   -0.0017064342169246405,   -0.00013254016461915194,   0.001379950530595239,   0.0027381922639710364,   0.0038629929995671075,   0.00469314561648354,   0.005188484672270496,   0.005331520270797173,   0.005127603779279628,   0.004603712117462733,   0.003805874949574743,   0.002795590463716705,   0.0016453546642979523,   0.00043371262469512446,   -0.0007599023966185753,   -0.0018601823173922036,   -0.0028005255375260817,   -0.0035269045389464504,   -0.004000809374671624,   -0.004201123998901283,   -0.0041248364214982024,   -0.0037866055141977718,   -0.003217201081156495,   -0.002461036451749209,   -0.0015728490334750694,   -0.0006139194751949582,   0.00035205388019120514,   0.0012630732141493894,   0.00206270799595422,   0.0027034918195447777,   0.003149646297186104,   0.003378966636892171,   0.003383798020458287,   0.003171069733063798,   0.002761372269113474,   0.0021872497160790234,   0.001490646413100908,   0.0007201199605118557,   -0.00007270416786720615,   -0.0008362811072038716,   -0.0015225308997630555,   -0.0020898280849919303,   -0.0025054206570715313,   -0.0027472737341876293,   -0.002805173737211216,   -0.0026809725121795087,   -0.0023880728837908185,   -0.0019503095882062893,   -0.0014001978810090166,   -0.0007764331474456598,   -0.00012101574080627546,   0.0005227215791995615,   0.001114010174529067,   0.0016163143908594045,   0.0019999944716107944,   0.0022438551652613466,   0.0023362996660734082,   0.0022757795325427503,   0.0020706069482448867,   0.0017381439666380053,   0.0013034181032845064,   0.000797299787369804,   0.00025437089746305067,   -0.00028941082924474056,   -0.0007990774224528687,   -0.0012428197120235036,   -0.0015940021826009595,   -0.0018326691770784896,   -0.0019466731268055683,   -0.0019322138049301621,   -0.001793859176708545,   -0.0015440089356608972,   -0.0012018797670332306,   -0.000792079634267749,   -0.00034287000733014057,   0.00011574982950438409,   0.0005540213551563383,   0.000944326487340492,   0.0012629191480759366,   0.0014913158837831816,   0.0016173698860029084,   0.0016358459625094193,   0.0015485794642970752,   0.0013641559100392852,   0.0010971690601370375,   0.00076711155347287,   0.0003969877785688768,   0.000011731244250112979,   -0.00036345552027128753,   -0.0007047206370885805,   -0.0009910724726092186,   -0.0012056256623930758,   -0.0013366209293878613,   -0.0013779636776103654,   -0.001329547081515234,   -0.0011970156074253917,   -0.0009912667647061417,   -0.0007276145004782092,   -0.0004246567309961579,   -0.00010298891272177306,   0.00021616348528699387,   0.0005123421637660198,   0.0007671603127385662,   0.0009654152376523162,   0.0010960206443678296,   0.0011519944458426004,   0.0011336520402371708,   0.0010414177918416578,   0.0008854470209305067,   0.0006774367303066042,   0.00043189857532070964,   0.00016555266050530552,   -0.00010383988081828998,   -0.00035877793517834314,   -0.0005832164731654933,   -0.0007635820851814426,   -0.0008895905757156121,   -0.0009547905850631885,   -0.0009568042954846602,   -0.000897362686812131,   -0.0007821208248811516,   -0.0006200732590545277,   -0.0004230233874884904,   -0.00020464262115528622,   0.000020399274920475764,   0.00023744003425329248,   0.00043275818252203974,   0.0005944430740028248,   0.0007131114699884057,   0.0007824338551323459,   0.0007994555785811166,   0.0007646822009075012,   0.0006819337788356992,   0.0005579915616065953,   0.0004020847729695572,   0.00022519228698186753,   0.00003931805718642359,   -0.00014333892110813761,   -0.0003111571247278629,   -0.00045382984825060316,   -0.0005629833876251326,   -0.0006326601935657222,   -0.0006596245513453766,   -0.000643486733954927,   -0.0005866424789596213,   -0.000494025244426794,   -0.0003727170550386536,   -0.0002314093793162946,   -0.00007982067509942405,   0.00007200257602023325,   0.00021429997639582185,   0.00033825202758871326,   0.00043650856599329027,   0.0005036088973071943,   0.0005362775862422715,   0.0005335608410174303,   0.0004967997326186481,   0.00042947404620668735,   0.00033691599464366406,   0.00022589524756009278,   0.00010416148869187228,   -0.000020166158144706697,   -0.00013896311495607429,   -0.0002449186151089871,   -0.00033162035114237876,   -0.00039418390808593776,   -0.000429457843764001,   -0.0004361099606421561,   -0.0004147068291232882,   -0.00036762652442667745,   -0.0002987866621040009,   -0.00021333152346519798,   -0.00011732693541286485,   -0.00001734509806522312,   0.00008008576600868937,   0.0001688760903703858,   0.0002434926958732427,   0.0002998149965532201,   0.0003347959010194655,   0.00034699041514079,   0.00033642180707489595,   0.00030458741680297754,   0.0002542878255710424,   0.00018940544462782473,   0.00011461260383671019,   0.000035032386958893286,   -0.000044098110812567134,   -0.00011776095198315651,   -0.0001814837031024612,   -0.00023160885529887796,   -0.00026547384374199176,   -0.0002815916087452791,   -0.00027965012631829084,   -0.000260526856272902,   -0.0002261646704303122,   -0.00017942246677473764,   -0.00012385235513596654,   -0.00006345356526636345,   -0.0000024003125301238913,   0.000055232882823971535,   0.00010572238453748261,   0.00014592102244833006,   0.00017343075036938728,   0.00018673567812981485,   0.00018524211352920688,   0.000169310394930918,   0.00014016394028108106,   0.00009980215742912645,   0.0000508377439375819,   -0.000003688661722200005,   -0.000060511281161317194,   -0.00011634577318997903,   -0.00016809634890038163,   -0.00021303349632444135,   -0.0002489361329191936,   -0.0002742106705087938,   -0.0002879368651991218,   -0.00028992567773032543,   -0.00028062548439992436,   -0.0002611586599345181,   -0.00023311541520489666,   -0.0001984953979661791,   -0.00015955622832839858,   -0.0001186388087130439,   -0.00007804283517097216,   -0.000039902767616475936,   -0.000006054306049617033,   0.000022051781979735328,   0.00004338987340945184,   0.00005738859167497046,   0.00006393518835997023,   0.0005301568549654419} \
  CONFIG.Coefficient_Fractional_Bits 18 \
  CONFIG.Coefficient_Sets 1 \
  CONFIG.Coefficient_Sign Signed \
  CONFIG.Coefficient_Structure Inferred \
  CONFIG.Coefficient_Width 16 \
  CONFIG.Data_Width 16 \
  CONFIG.Filter_Architecture Systolic_Multiply_Accumulate \
  CONFIG.Number_Paths 2 \
  CONFIG.Output_Rounding_Mode Truncate_LSBs \
  CONFIG.Output_Width 18 \
  CONFIG.Passband_Max 0.07 \
  CONFIG.Quantization Quantize_Only \
  CONFIG.Sample_Frequency 0.0390625 \
] [get_bd_cells fir_compiler_1]
create_bd_cell -type ip -vlnv xilinx.com:ip:xlconcat:2.1 xlconcat_2
create_bd_cell -type ip -vlnv xilinx.com:ip:xlconstant:1.1 xlconstant_0
create_bd_cell -type ip -vlnv xilinx.com:ip:xlconstant:1.1 xlconstant_3
set_property -dict {CONFIG.CONST_VAL 0 CONFIG.CONST_WIDTH 16} [get_bd_cells xlconstant_3]
create_bd_cell -type ip -vlnv xilinx.com:ip:xlslice:1.0 xlslice_3
set_property -dict {CONFIG.DIN_FROM 39 CONFIG.DIN_TO 24 CONFIG.DIN_WIDTH 48 CONFIG.DOUT_WIDTH 16} [get_bd_cells xlslice_3]
create_bd_cell -type ip -vlnv xilinx.com:ip:xlslice:1.0 xlslice_4
set_property -dict {CONFIG.DIN_FROM 15 CONFIG.DIN_WIDTH 48 CONFIG.DOUT_WIDTH 16} [get_bd_cells xlslice_4]
create_bd_cell -type module -reference cordic cordic_0
create_bd_cell -type module -reference cordic cordic_1
create_bd_cell -type module -reference cordic cordic_2
create_bd_cell -type ip -vlnv xilinx.com:ip:xlconcat:2.1 xlconcat_0
set_property -dict {CONFIG.NUM_PORTS 3} [get_bd_cells xlconcat_0]
create_bd_cell -type ip -vlnv xilinx.com:ip:axis_subset_converter:1.1 axis_subset_converter_0
set_property -dict [list \
  CONFIG.M_HAS_TREADY 0 \
  CONFIG.M_TDATA_NUM_BYTES 2 \
  CONFIG.S_HAS_TREADY 0 \
  CONFIG.S_TDATA_NUM_BYTES 2 \
  CONFIG.TDATA_REMAP {tdata[15:0]} \
] [get_bd_cells axis_subset_converter_0]
create_bd_cell -type module -reference phase_accumulator phase_accumulator_0
create_bd_cell -type module -reference phase_accumulator phase_accumulator_1

# ---- hierarchy /TX/Tone_CW ----
current_bd_instance /TX/Tone_CW
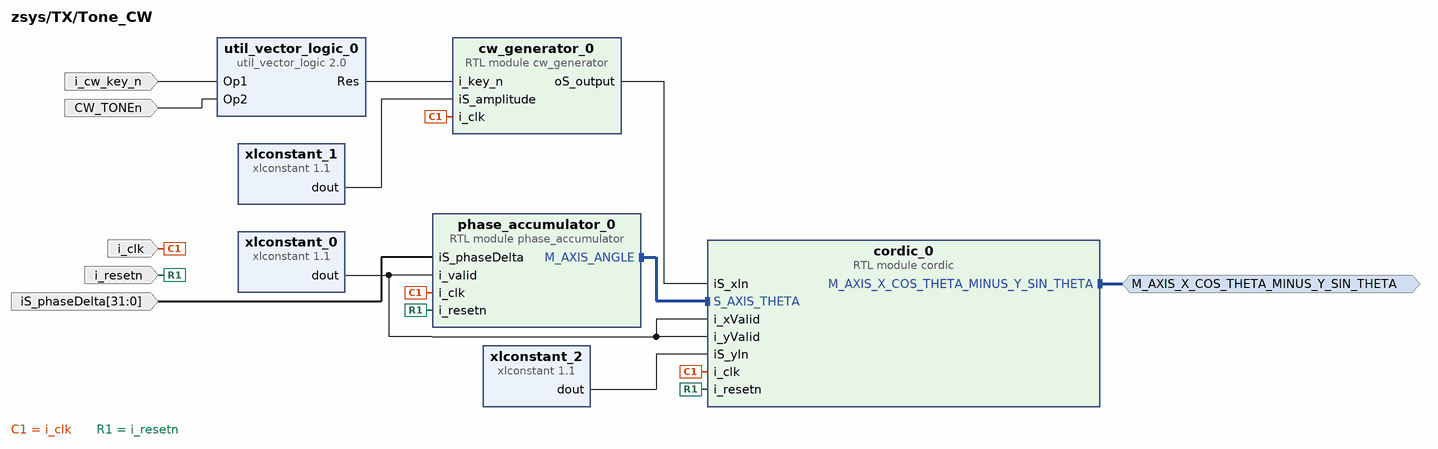
[diagram p5: block diagram inside /TX/Tone_CW]
create_bd_intf_pin -mode Master -vlnv xilinx.com:interface:axis_rtl:1.0 M_AXIS_X_COS_THETA_MINUS_Y_SIN_THETA
create_bd_pin -dir I i_clk
create_bd_pin -dir I i_resetn
create_bd_pin -dir I -from 31 -to 0 iS_phaseDelta
create_bd_pin -dir I i_cw_key_n
create_bd_pin -dir I CW_TONEn

create_bd_cell -type ip -vlnv xilinx.com:ip:xlconstant:1.1 xlconstant_0
create_bd_cell -type module -reference cordic cordic_0
create_bd_cell -type ip -vlnv xilinx.com:ip:xlconstant:1.1 xlconstant_2
set_property -dict {CONFIG.CONST_VAL 0 CONFIG.CONST_WIDTH 16} [get_bd_cells xlconstant_2]
create_bd_cell -type module -reference cw_generator cw_generator_0
create_bd_cell -type ip -vlnv xilinx.com:ip:xlconstant:1.1 xlconstant_1
set_property -dict {CONFIG.CONST_VAL 32000 CONFIG.CONST_WIDTH 16} [get_bd_cells xlconstant_1]
create_bd_cell -type ip -vlnv xilinx.com:ip:util_vector_logic:2.0 util_vector_logic_0
set_property -dict {CONFIG.C_SIZE 1} [get_bd_cells util_vector_logic_0]
create_bd_cell -type module -reference phase_accumulator phase_accumulator_0

# ---- connections ----

current_bd_instance /Control
connect_bd_net [get_bd_pins clk] [get_bd_pins binary_to_bcd_0/i_clk] [get_bd_pins Segment_Driver_0/i_clk]
connect_bd_net [get_bd_pins resetn] [get_bd_pins binary_to_bcd_0/i_resetn] [get_bd_pins Segment_Driver_0/i_resetn]
connect_bd_net [get_bd_pins Segment_Driver_0/o_ledClk] [get_bd_pins LED_Clock]
connect_bd_net [get_bd_pins Segment_Driver_0/o_data] [get_bd_pins LED_Data]
connect_bd_net [get_bd_pins Segment_Driver_0/o_lat] [get_bd_pins LED_Latch]
connect_bd_net [get_bd_pins Segment_Driver_0/o_blank] [get_bd_pins LED_Blank]
connect_bd_net [get_bd_pins binary_to_bcd_0/o_bcd] [get_bd_pins o_bcd] [get_bd_pins Segment_Driver_0/i_bcdData]
connect_bd_net [get_bd_pins i_dispFrequency] [get_bd_pins binary_to_bcd_0/i_binary]
connect_bd_net [get_bd_pins i_dispFrequencyMode] [get_bd_pins Segment_Driver_0/i_mode]
connect_bd_net [get_bd_pins i_dispBlank] [get_bd_pins Segment_Driver_0/i_blank]

current_bd_instance /AF
connect_bd_intf_net [get_bd_intf_pins S_AXI] [get_bd_intf_pins axi_iic_0/S_AXI]
connect_bd_intf_net [get_bd_intf_pins M_AXIS_RIGHT_ADC] [get_bd_intf_pins axis_subset_converter_1/M_AXIS]
connect_bd_intf_net [get_bd_intf_pins adau1361_handler_0/M_AXIS_LEFT_ADC] [get_bd_intf_pins overdrive_warning_0/S_AXIS_DATA]
connect_bd_intf_net [get_bd_intf_pins S_AXIS_LEFT_DAC] [get_bd_intf_pins adau1361_handler_0/S_AXIS_LEFT_DAC]
connect_bd_intf_net [get_bd_intf_pins S_AXIS_RIGHT_DAC] [get_bd_intf_pins adau1361_handler_0/S_AXIS_RIGHT_DAC]
connect_bd_intf_net [get_bd_intf_pins M_AXIS_LEFT_ADC] [get_bd_intf_pins axis_subset_converter_0/M_AXIS]
connect_bd_intf_net [get_bd_intf_pins overdrive_warning_1/S_AXIS_DATA] [get_bd_intf_pins adau1361_handler_0/M_AXIS_RIGHT_ADC]
connect_bd_intf_net [get_bd_intf_pins af_iic] [get_bd_intf_pins axi_iic_0/IIC]
connect_bd_net [get_bd_pins axi_iic_0/iic2intc_irpt] [get_bd_pins af_iic_irq]
connect_bd_net -net adau1361_handler_0_o_af_dac_data [get_bd_pins adau1361_handler_0/o_dacData] [get_bd_pins AF_DAC_DATA]
connect_bd_net [get_bd_pins adau1361_handler_0/o_mclk] [get_bd_pins AF_ADC_DAC_MCLK]
connect_bd_net [get_bd_pins adau1361_handler_0/o_bclk] [get_bd_pins AF_ADC_DAC_BCLK]
connect_bd_net [get_bd_pins adau1361_handler_0/o_lrclk] [get_bd_pins AF_ADC_DAC_LRCLK]
connect_bd_net -net af_clk_1 [get_bd_pins i_clk] \
  [get_bd_pins axi_iic_0/s_axi_aclk] [get_bd_pins overdrive_warning_0/i_clk] [get_bd_pins overdrive_warning_1/i_clk] \
  [get_bd_pins fir_compiler_0/aclk] [get_bd_pins axis_subset_converter_0/aclk] [get_bd_pins axis_subset_converter_1/aclk] \
  [get_bd_pins adau1361_handler_0/i_clk]
connect_bd_net [get_bd_pins i_resetn] \
  [get_bd_pins axi_iic_0/s_axi_aresetn] [get_bd_pins overdrive_warning_0/i_resetn] [get_bd_pins overdrive_warning_1/i_resetn] \
  [get_bd_pins axis_subset_converter_0/aresetn] [get_bd_pins axis_subset_converter_1/aresetn] \
  [get_bd_pins adau1361_handler_0/i_resetn]
connect_bd_net [get_bd_pins AF_ADC_DATA] [get_bd_pins adau1361_handler_0/i_adcData]
connect_bd_net [get_bd_pins overdrive_warning_0/o_positiveOverload] [get_bd_pins util_vector_logic_0/Op1]
connect_bd_net [get_bd_pins overdrive_warning_0/o_negativeOverload] [get_bd_pins util_vector_logic_0/Op2]
connect_bd_net [get_bd_pins util_vector_logic_0/Res] [get_bd_pins overdrive_left]
connect_bd_net [get_bd_pins util_vector_logic_1/Res] [get_bd_pins overdrive_right]
connect_bd_net [get_bd_pins overdrive_warning_1/o_positiveOverload] [get_bd_pins util_vector_logic_1/Op1]
connect_bd_net [get_bd_pins overdrive_warning_1/o_negativeOverload] [get_bd_pins util_vector_logic_1/Op2]
connect_bd_net [get_bd_pins adau1361_handler_0/o_error] [get_bd_pins o_error]
connect_bd_net [get_bd_pins overdrive_warning_1/oS_data] [get_bd_pins xlconcat_0/In1]
connect_bd_net [get_bd_pins overdrive_warning_0/oS_data] [get_bd_pins xlconcat_0/In0]
connect_bd_net [get_bd_pins xlconcat_0/dout] [get_bd_pins fir_compiler_0/s_axis_data_tdata]
connect_bd_net [get_bd_pins overdrive_warning_0/o_valid] [get_bd_pins fir_compiler_0/s_axis_data_tvalid]
connect_bd_net [get_bd_pins fir_compiler_0/m_axis_data_tdata] [get_bd_pins xlslice_0/Din] [get_bd_pins xlslice_1/Din]
connect_bd_net [get_bd_pins xlslice_1/Dout] [get_bd_pins axis_subset_converter_0/s_axis_tdata]
connect_bd_net [get_bd_pins fir_compiler_0/m_axis_data_tvalid] \
  [get_bd_pins axis_subset_converter_0/s_axis_tvalid] [get_bd_pins axis_subset_converter_1/s_axis_tvalid]
connect_bd_net [get_bd_pins xlslice_0/Dout] [get_bd_pins axis_subset_converter_1/s_axis_tdata]
